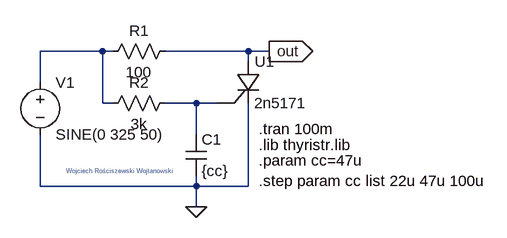
[diagram p0: schematic thyristor.asc]
thyristor.asc, the LTspice schematic file:
Version 4
SHEET 1 880 680
WIRE 176 16 80 16
WIRE 192 16 176 16
WIRE 400 16 272 16
WIRE 432 16 400 16
WIRE 400 32 400 16
WIRE 80 64 80 16
WIRE 176 96 176 16
WIRE 192 96 176 96
WIRE 320 96 272 96
WIRE 352 96 320 96
WIRE 320 144 320 96
WIRE 80 224 80 144
WIRE 320 224 320 208
WIRE 320 224 80 224
WIRE 400 224 400 96
WIRE 400 224 320 224
WIRE 320 256 320 224
FLAG 432 16 out
IOPIN 432 16 Out
FLAG 320 256 0
SYMBOL res 288 0 R90
WINDOW 0 0 56 VBottom 2
WINDOW 3 32 56 VTop 2
SYMATTR InstName R1
SYMATTR Value 100
SYMBOL res 288 80 R90
WINDOW 0 0 56 VBottom 2
WINDOW 3 32 56 VTop 2
SYMATTR InstName R2
SYMATTR Value 3k
SYMBOL cap 304 144 R0
SYMATTR InstName C1
SYMATTR Value {cc}
SYMBOL voltage 80 48 R0
WINDOW 123 0 0 Left 0
WINDOW 39 0 0 Left 0
SYMATTR InstName V1
SYMATTR Value SINE(0 325 50)
SYMBOL Misc\\2N5171 384 32 R0
SYMATTR InstName U1
TEXT 416 136 Left 2 !.tran 100m
TEXT 416 160 Left 2 !.lib thyristr.lib
TEXT 416 184 Left 2 !.param cc=47u
TEXT 416 216 Left 2 !.step param cc list 22u 47u 100u
TEXT 120 200 Left 0 ;Wojciech Rościszewski Wojtanowski

The netlist it stands for:
* thyristor.asc
R1 out N001 100
R2 N002 N001 3k
C1 N002 0 {cc}
V1 N001 0 SINE(0 325 50)
XU1 out 0 N002 2N5171 2n5171 2N5171  ; pins + - gate
.tran 100m
.lib thyristr.lib
.param cc=47u
.step param cc list 22u 47u 100u
* Wojciech Rościszewski Wojtanowski
.lib thyristr.lib
.backanno
.end